# EAGLE design BPW5011-Digital-Wing (EAGLE 6.3)
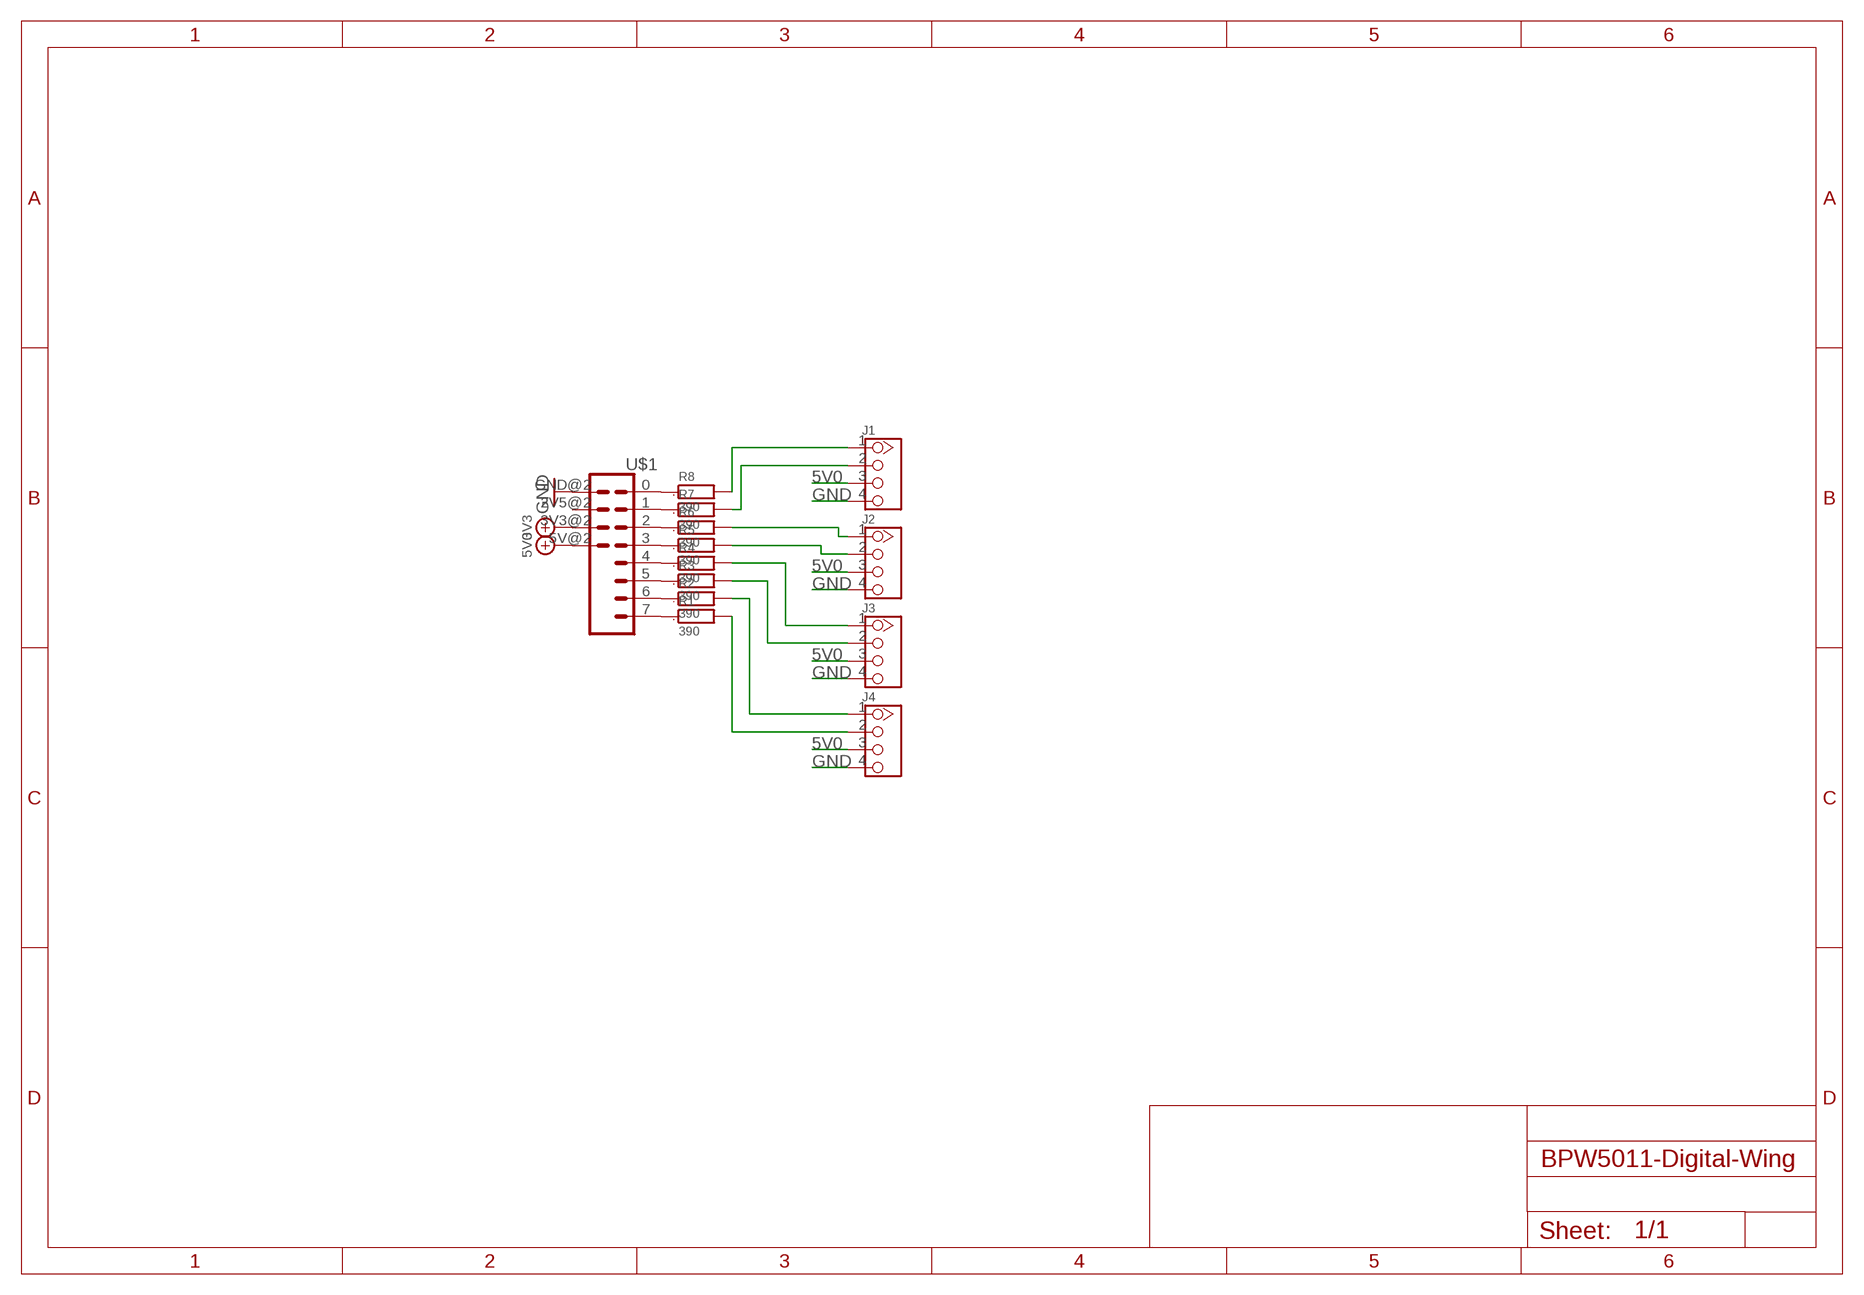
[diagram p0: schematic, sheet 1]

## Parts
J1  CONNECTOR_TWIG-2.0-LEADED  [CONNECTOR_4P-LEADED-2.0]
J2  CONNECTOR_TWIG-2.0-LEADED  [CONNECTOR_4P-LEADED-2.0]
J3  CONNECTOR_TWIG-2.0-LEADED  [CONNECTOR_4P-LEADED-2.0]
J4  CONNECTOR_TWIG-2.0-LEADED  [CONNECTOR_4P-LEADED-2.0]
R1  390  R0805  [0805]
R2  390  R0805  [0805]
R3  390  R0805  [0805]
R4  390  R0805  [0805]
R5  390  R0805  [0805]
R6  390  R0805  [0805]
R7  390  R0805  [0805]
R8  390  R0805  [0805]
U$1  WING8WING8_NOHOLES  [WINGSIDE_8BIT_NOHOLES]

## Nets
3V3: U$1.3V3@2(3V3)
5V0: J1.3 J2.3 J3.3 J4.3 U$1.5V@2(5V)
GND: J1.4 J2.4 J3.4 J4.4 U$1.GND@2(GND)
N$1: J1.1 R8.2
N$2: J1.2 R7.2
N$3: J2.1 R6.2
N$4: J2.2 R5.2
N$5: J3.1 R4.2
N$6: J3.2 R3.2
N$7: J4.1 R2.2
N$8: J4.2 R1.2
N$9: R1.1 U$1.7
N$10: R2.1 U$1.6
N$11: R3.1 U$1.5
N$12: R4.1 U$1.4
N$13: R5.1 U$1.3
N$14: R6.1 U$1.2
N$15: R7.1 U$1.1
N$16: R8.1 U$1.0
Unconnected: U$1.2V5@2(2V5)

## Library data of the parts
J1-J4 = GadgetFactory_6.0:CONNECTOR_TWIG-2.0-LEADED
R1-R8 = GadgetFactory:R: RESISTOR, European symbol
U$1 = Papilio:WING8

## Board
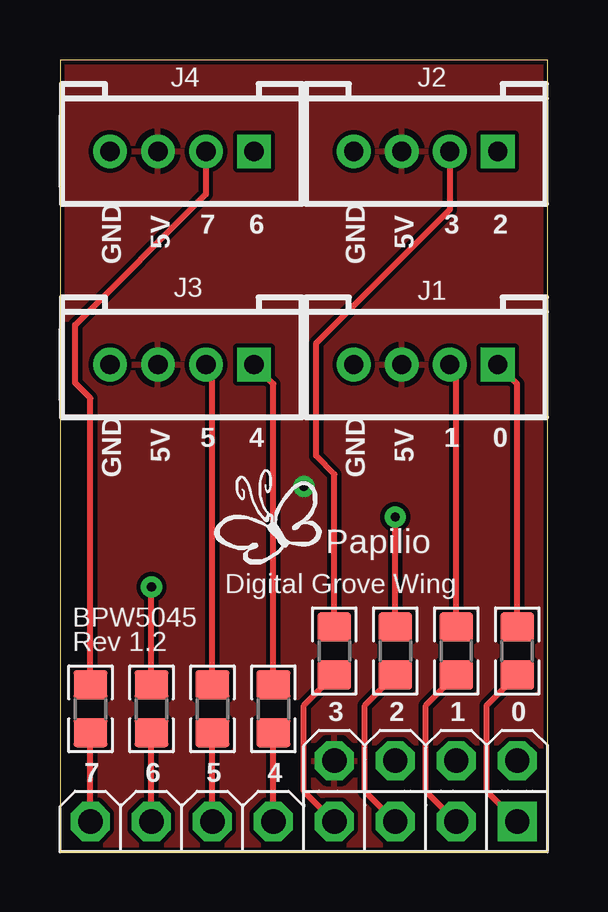
[diagram p1: board, top side]
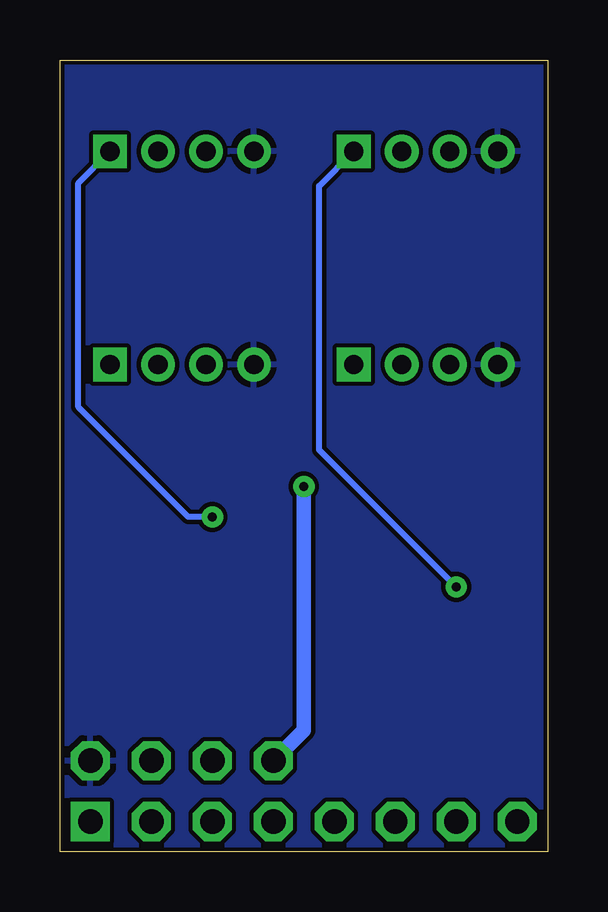
[diagram p2: board, bottom side, seen from below]

Size 20.32 x 33.02 mm. Coordinates in mm from the lower left corner, seen from the top.
Outline: 0,0 20.32,0 20.32,33.02 0,33.02 0,0
Copper layers (1*16): Top 0.035mm / dielectric 1.5mm / Bottom 0.035mm
Design rules "SparkFun_Derived_GoldePheonix_7mil *": minimum track width 7mil, minimum drill 15mil, track to track 7mil, track to pad 7mil, pad to pad 7mil, via to via 7mil, smd to smd 7mil, copper to edge 7mil, drill to drill 7mil, minimum pad ring 12mil, minimum via ring 10mil, stop-mask expansion 4mil, vias tented up to drill 18mil, thermal gap 10mil

### Footprints (pad centres in the part's own frame; a part is rotated, then mirrored left to right if it is on the bottom)
CONNECTOR_4P-LEADED-2.0 = drill 0.8 pad 1.27 square: 1 -3,0 | drill 0.8 pad 1.27: 2 -1,0; 3 1,0; 4 3,0
0805 = smd 1.2 x 1.4: 1 -1,0; 2 1,0
WINGSIDE_8BIT_NOHOLES = drill 1.016 square: 0 19.05,1.27 | drill 1.016 octagon: 1 16.51,1.27; 2 13.97,1.27; 2V5@2 16.51,3.81; 3 11.43,1.27; 3V3@2 13.97,3.81; 4 8.89,1.27; 5 6.35,1.27; 5V@2 11.43,3.81; 6 3.81,1.27; 7 1.27,1.27; GND@2 19.05,3.81

### Placement (x,y rotation side)
J1  15.24,20.32 180 top
J2  15.24,29.21 180 top
J3  5.08,20.32 180 top
J4  5.08,29.21 180 top
R1  1.27,5.97 90 top
R2  3.81,5.97 90 top
R3  6.35,5.97 90 top
R4  8.89,5.97 90 top
R5  11.43,8.38 90 top
R6  13.97,8.38 90 top
R7  16.51,8.38 90 top
R8  19.05,8.38 90 top
U$1  0,0 0 top
U$2  [GADGETFACTORY_LOGO]  6.22,11.43 0 top

### Tracks (layer width: path | path; a pad name or v marks a point on that pad's centre or on a via)
5V0  (via drill 0.38)
  Bottom 0.61: v10.16,15.24 10.16,5.08 U$1.5V@2
  pour Top: 0,0 0,33.02 20.32,33.02 20.32,0
GND
  pour Bottom: 0,33.02 20.32,33.02 20.32,0 0,0
N$1
  Top 0.254: R8.2 19.05,19.51 J1.1
N$2
  Top 0.254: R7.2 16.51,20.05 J1.2
N$3  (via drill 0.38)
  Top 0.254: R6.2 v13.97,13.97
  Bottom 0.254: J2.1 19.56,27.89 19.56,18.54 14.99,13.97 v13.97,13.97
N$4
  Top 0.254: J2.2 16.24,26.78 10.67,21.21 10.67,16.51 11.43,15.75 R5.2
N$5
  Top 0.254: J3.1 8.89,19.51 R4.2
N$6
  Top 0.254: R3.2 6.35,20.05 J3.2
N$7  (via drill 0.38)
  Top 0.254: R2.2 v3.81,11.05
  Bottom 0.254: J4.1 9.53,27.77 9.53,16.76 v3.81,11.05
N$8
  Top 0.254: J4.2 6.08,27.42 0.64,21.97 0.64,19.56 1.27,18.92 R1.2
N$9
  Top 0.254: U$1.7 R1.1
N$10
  Top 0.254: U$1.6 R2.1
N$11
  Top 0.254: U$1.5 R3.1
N$12
  Top 0.254: U$1.4 R4.1
N$13
  Top 0.254: U$1.3 10.16,2.54 10.16,6.11 R5.1
N$14
  Top 0.254: U$1.2 12.7,2.54 12.7,6.11 R6.1
N$15
  Top 0.254: U$1.1 15.24,2.54 15.24,6.11 R7.1
N$16
  Top 0.254: U$1.0 17.78,2.54 17.78,6.11 R8.1

### Text on the board
tPlace: Papilio | Digital Grove Wing | BPW5045 | Rev 1.2
tNames: 7 | 6 | 3 | 2 | GND | 5V | GND | 5V | 5 | 4 | 1 | 0 | GND | 5V | GND | 5V | 3 | 2 | 1 | 0 | 7 | 6 | 5 | 4